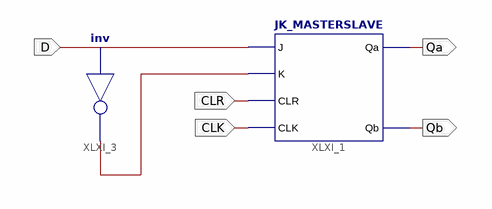
[diagram p0: schematic sheet 1]
// Xilinx ISE schematic D_FLIPFLOP.sch (artix7) as structural Verilog: 2 symbols, 5 ports
module D_FLIPFLOP (
  input  CLR,
  input  CLK,
  input  D,
  output Qa,
  output Qb
);

  wire XLXN_10;

  JK_MASTERSLAVE XLXI_1 (.J(D), .K(XLXN_10), .CLR(CLR), .CLK(CLK), .Qa(Qa), .Qb(Qb));
  not XLXI_3 (XLXN_10, D);
endmodule
